# Altium schematic sheet Sch_external_connectors.SchDoc
size A
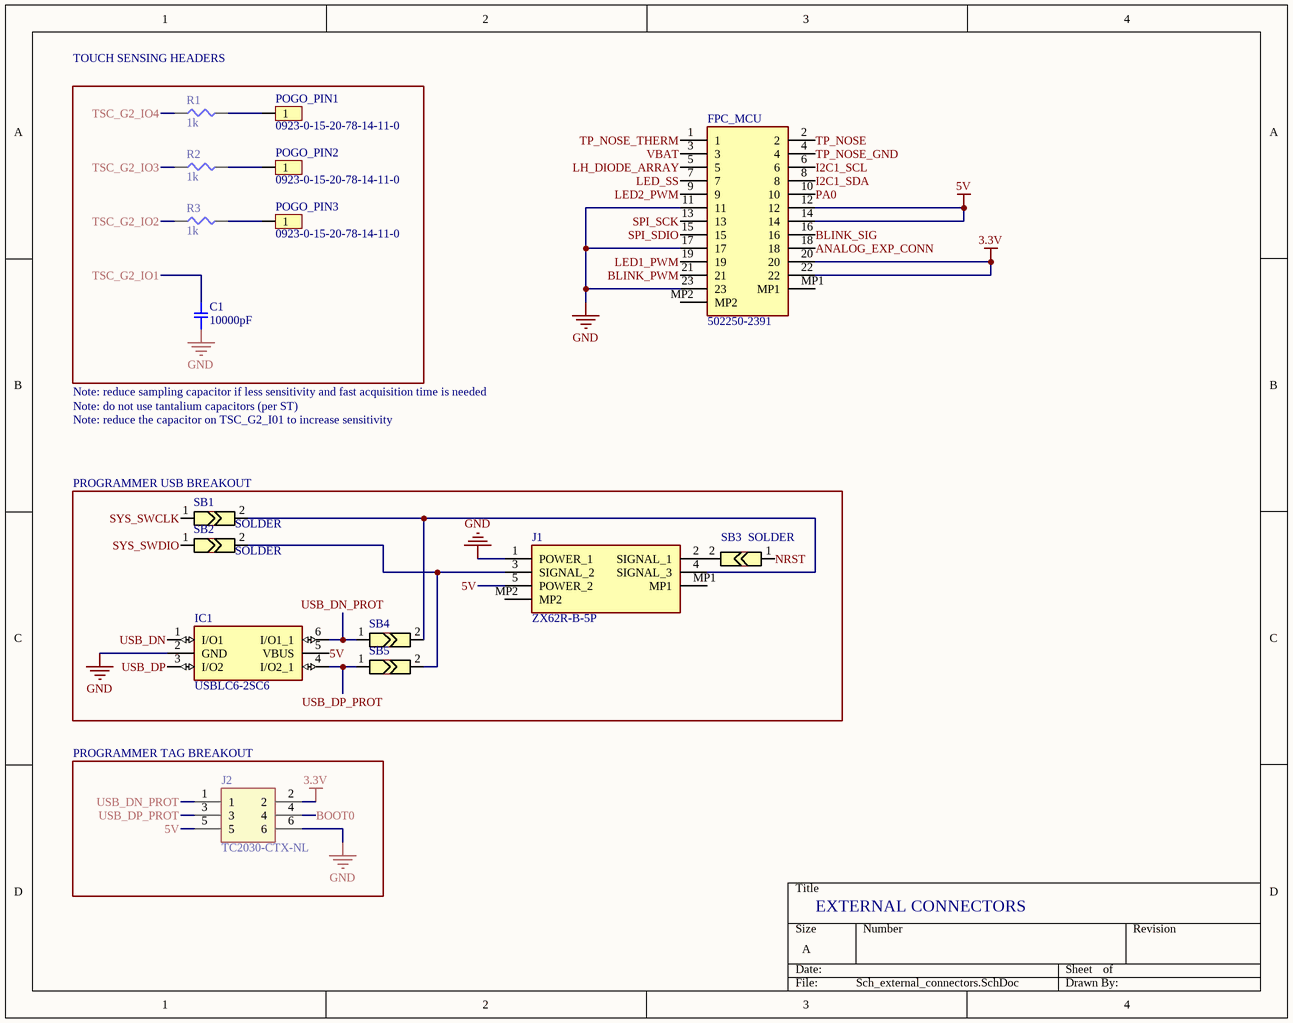
[diagram p0: Sch_external_connectors.SchDoc]

## Parts
C1  10000pF  [SMD-0402C]
FPC_MCU  502250-2391  [5022502391]
IC1  USBLC6-2SC6  [SOT95P280X145-6N]
J1  ZX62R-B-5P  [USB307030A]
J2  TC2030-CTX-NL  [TC2030MCPNL10]
POGO_PIN1  0923-0-15-20-78-14-11-0  [0923-0-15-20-78-14-11-0]
POGO_PIN2  0923-0-15-20-78-14-11-0  [0923-0-15-20-78-14-11-0]
POGO_PIN3  0923-0-15-20-78-14-11-0  [0923-0-15-20-78-14-11-0]
R1  1k  [SMD-0402-RES]
R2  1k  [SMD-0402-RES]
R3  1k  [SMD-0402-RES]
SB1  SOLDER_JUMPER  [JUMPER_SMD]  (value not drawn)
SB2  SOLDER_JUMPER  [JUMPER_SMD]  (value not drawn)
SB3  SOLDER_JUMPER  [JUMPER_SMD]  (value not drawn)
SB4  SOLDER_JUMPER  [JUMPER_SMD]  (value not drawn)
SB5  SOLDER_JUMPER  [JUMPER_SMD]  (value not drawn)

## Blocks framed on the sheet
PROGRAMMER TAG BREAKOUT: J2

## Nets
3.3V: FPC_MCU.20 FPC_MCU.22 J2.2
5V: FPC_MCU.12 FPC_MCU.14 IC1.5(VBUS) J1.5(POWER_2) J2.5
GND: C1.1 FPC_MCU.11 FPC_MCU.17 FPC_MCU.23 IC1.2(GND) J1.1(POWER_1) J2.6
ANALOG_EXP_CONN: FPC_MCU.18
BLINK_PWM: FPC_MCU.21
BLINK_SIG: FPC_MCU.16
BOOT0: J2.4
I2C1_SCL: FPC_MCU.6
I2C1_SDA: FPC_MCU.8
LED1_PWM: FPC_MCU.19
LED2_PWM: FPC_MCU.9
LED_SS: FPC_MCU.7
LH_DIODE_ARRAY: FPC_MCU.5
NRST: SB3.1
PA0: FPC_MCU.10
SPI_SCK: FPC_MCU.13
SPI_SDIO: FPC_MCU.15
SYS_SWCLK: SB1.1
SYS_SWDIO: SB2.1
TP_NOSE: FPC_MCU.2
TP_NOSE_GND: FPC_MCU.4
TP_NOSE_THERM: FPC_MCU.1
TSC_G2_IO1: C1.2
TSC_G2_IO2: R3.1
TSC_G2_IO3: R2.1
TSC_G2_IO4: R1.1
USB_DN: IC1.1(I/O1)
USB_DN_PROT: IC1.6(I/O1_1) J2.1 SB4.1
USB_DP: IC1.3(I/O2)
USB_DP_PROT: IC1.4(I/O2_1) J2.3 SB5.1
VBAT: FPC_MCU.3
NetJ1_2: J1.2(SIGNAL_1) SB3.2
NetJ1_3: J1.3(SIGNAL_2) SB2.2 SB5.2
NetJ1_4: J1.4(SIGNAL_3) SB1.2 SB4.2
NetPOGO_PIN1_1: POGO_PIN1.1 R1.2
NetPOGO_PIN2_1: POGO_PIN2.1 R2.2
NetPOGO_PIN3_1: POGO_PIN3.1 R3.2

Not connected (* = marked no-connect by the designer): FPC_MCU MP1 MP2; J1 MP1 MP2

## Notes on the sheet
- (near R1) TOUCH SENSING HEADERS
- Note: reduce sampling capacitor if less sensitivity and fast acquisition time is needed
- Note: do not use tantalium capacitors (per ST)
- Note: reduce the capacitor on TSC_G2_I01 to increase sensitivity
- (near SB1) PROGRAMMER USB BREAKOUT
- (near SB1) SOLDER
- (near SB2) SOLDER
- (near SB3) SOLDER
- EXTERNAL CONNECTORS

## Library data of the parts
C1 = GCM155R71H103KA55D: CAP CER 10000PF 50V X7R 0402; Manufacturer: Murata Electronics North America; Factory Stock: 0; Unit Price (USD): 0.1; Minimum Quantity: 1; Tolerance: ±10%; Datasheets: http://www.murata.com/~/media/webrenewal/support/library/catalog/products/capacitor/mlcc/c03e.ashx; Image: //media.digikey.com/Renders/Murata%20Renders/ZRB-SERIES-0402.jpg; Digi-Key Part Number: 490-4762-1-ND; Part Number: GCM155R71H103KA55D; Quantity Available: 650067; @ qty: 0; Packaging: Cut Tape (CT); Series: GCM; Part Status: Active; Value: 10000pF; Voltage: 50V; Temperature Coefficient: X7R; Operating Temperature: -55°C ~ 125°C; Features: -; Ratings: AEC-Q200; Applications: Automotive; Mounting Type: Surface Mount, MLCC; Package / Case: 0402 (1005 Metric); Size / Dimension: 0.039" L x 0.020" W (1.00mm x 0.50mm); Height - Seated (Max): -; Thickness (Max): 0.022" (0.55mm); Lead Spacing: -; Lead Style: -
FPC_MCU = 502250-2391: Connector; Manufacturer_Name: Molex; Datasheet Link: https://www.molex.com/pdm_docs/sd/5022501791_sd.pdf; Height: 1.85mm; Manufacturer_Part_Number: 502250-2391; Mouser Part Number: 538-502250-2391; Mouser Price/Stock: https://www.mouser.com/Search/Refine.aspx?Keyword=538-502250-2391; System: Connector
IC1 = USBLC6-2SC6: Integrated Circuit; Manufacturer_Name: STMicroelectronics; Allied_Number: 70389689; Datasheet Link: http://www.st.com/st-web-ui/static/active/en/resource/technical/document/datasheet/CD00050750.pdf; Height: 1.45mm; Manufacturer_Part_Number: USBLC6-2SC6; Mouser Part Number: 511-USBLC6-2SC6; Mouser Price/Stock: https://www.mouser.com/Search/Refine.aspx?Keyword=511-USBLC6-2SC6; RS Part Number: 9206266; RS Price/Stock: https://uk.rs-online.com/web/p/products/9206266; Allied Price/Stock: http://www.alliedelec.com/stmicroelectronics-usblc6-2sc6/70389689/
J1 = USB3070-30-A: Connector; Manufacturer_Name: GCT (GLOBAL CONNECTOR TECHNOLOGY); Datasheet Link: https://componentsearchengine.com/Datasheets/2/USB3070-30-A.pdf; Height: 2.8mm; Manufacturer_Part_Number: USB3070-30-A
J2 = TC2030-CTX-NL: Connector; Manufacturer_Name: Tag Connect; Datasheet Link: http://www.tag-connect.com/Materials/TC2030-CTX.pdf; Height: 18mm; Manufacturer_Part_Number: TC2030-CTX-NL
R1-R3 = ERJ-2GEJ102X: RES SMD 1K OHM 5% 1/10W 0402; Manufacturer: Panasonic Electronic Components; Factory Stock: 0; Unit Price (USD): 0.00350; @ qty: 1500; Minimum Quantity: 1; Power (Watts): 0.1W, 1/10W; Temperature Coefficient: ±200ppm/°C; Part Number: ERJ-2GEJ102X; Datasheets: http://industrial.panasonic.com/www-cgi/jvcr13pz.cgi?E+PZ+3+AOA0001+ERJ2GEJ102X+7+WW; Image: //media.digikey.com/Photos/Panasonic%20Photos/ERJ-PA2-Series.jpg; Digi-Key Part Number: P1.0KJCT-ND; Quantity Available: 1939857; Packaging: Cut Tape (CT); Series: ERJ; Part Status: Active; Value: 1k; Tolerance: ±5%; Composition: Thick Film; Features: Automotive AEC-Q200; Operating Temperature: -55°C ~ 155°C; Package / Case: 0402 (1005 Metric); Supplier Device Package: 0402; Size / Dimension: 0.039" L x 0.020" W (1.00mm x 0.50mm); Height - Seated (Max): 0.016" (0.40mm); Number of Terminations: 2; Failure Rate: -